# Altium schematic sheet Tiny817_Xplained_Pro_Target_MCU.SchDoc: Target MCU
size A3; Organization: ATMEL Norway; Address1: Vestre Rosten 79; Address2: N-7075 TILLER; Address3: NORWAY; DocumentNumber: A09-2654; Revision: 4; SheetNumber: 2; SheetTotal: 9; PageSetup: Record=PageOptions|CenterHorizontal=True|CenterVertical=True|PrintScale=1.01|XCorrection=1.00|YCorrection=1.00|PrintKind=1|BorderSize=5000000|LeftOffset=0|BottomOffset=0|Orientation=2|PaperLength=1000|PaperWidth=1000|Scale=100|PaperSource=7|PrintQuality=-4|MediaType=1|DitherType=10|PaperKind=A3 (297 x 420 mm)|PrintScaleMode=1
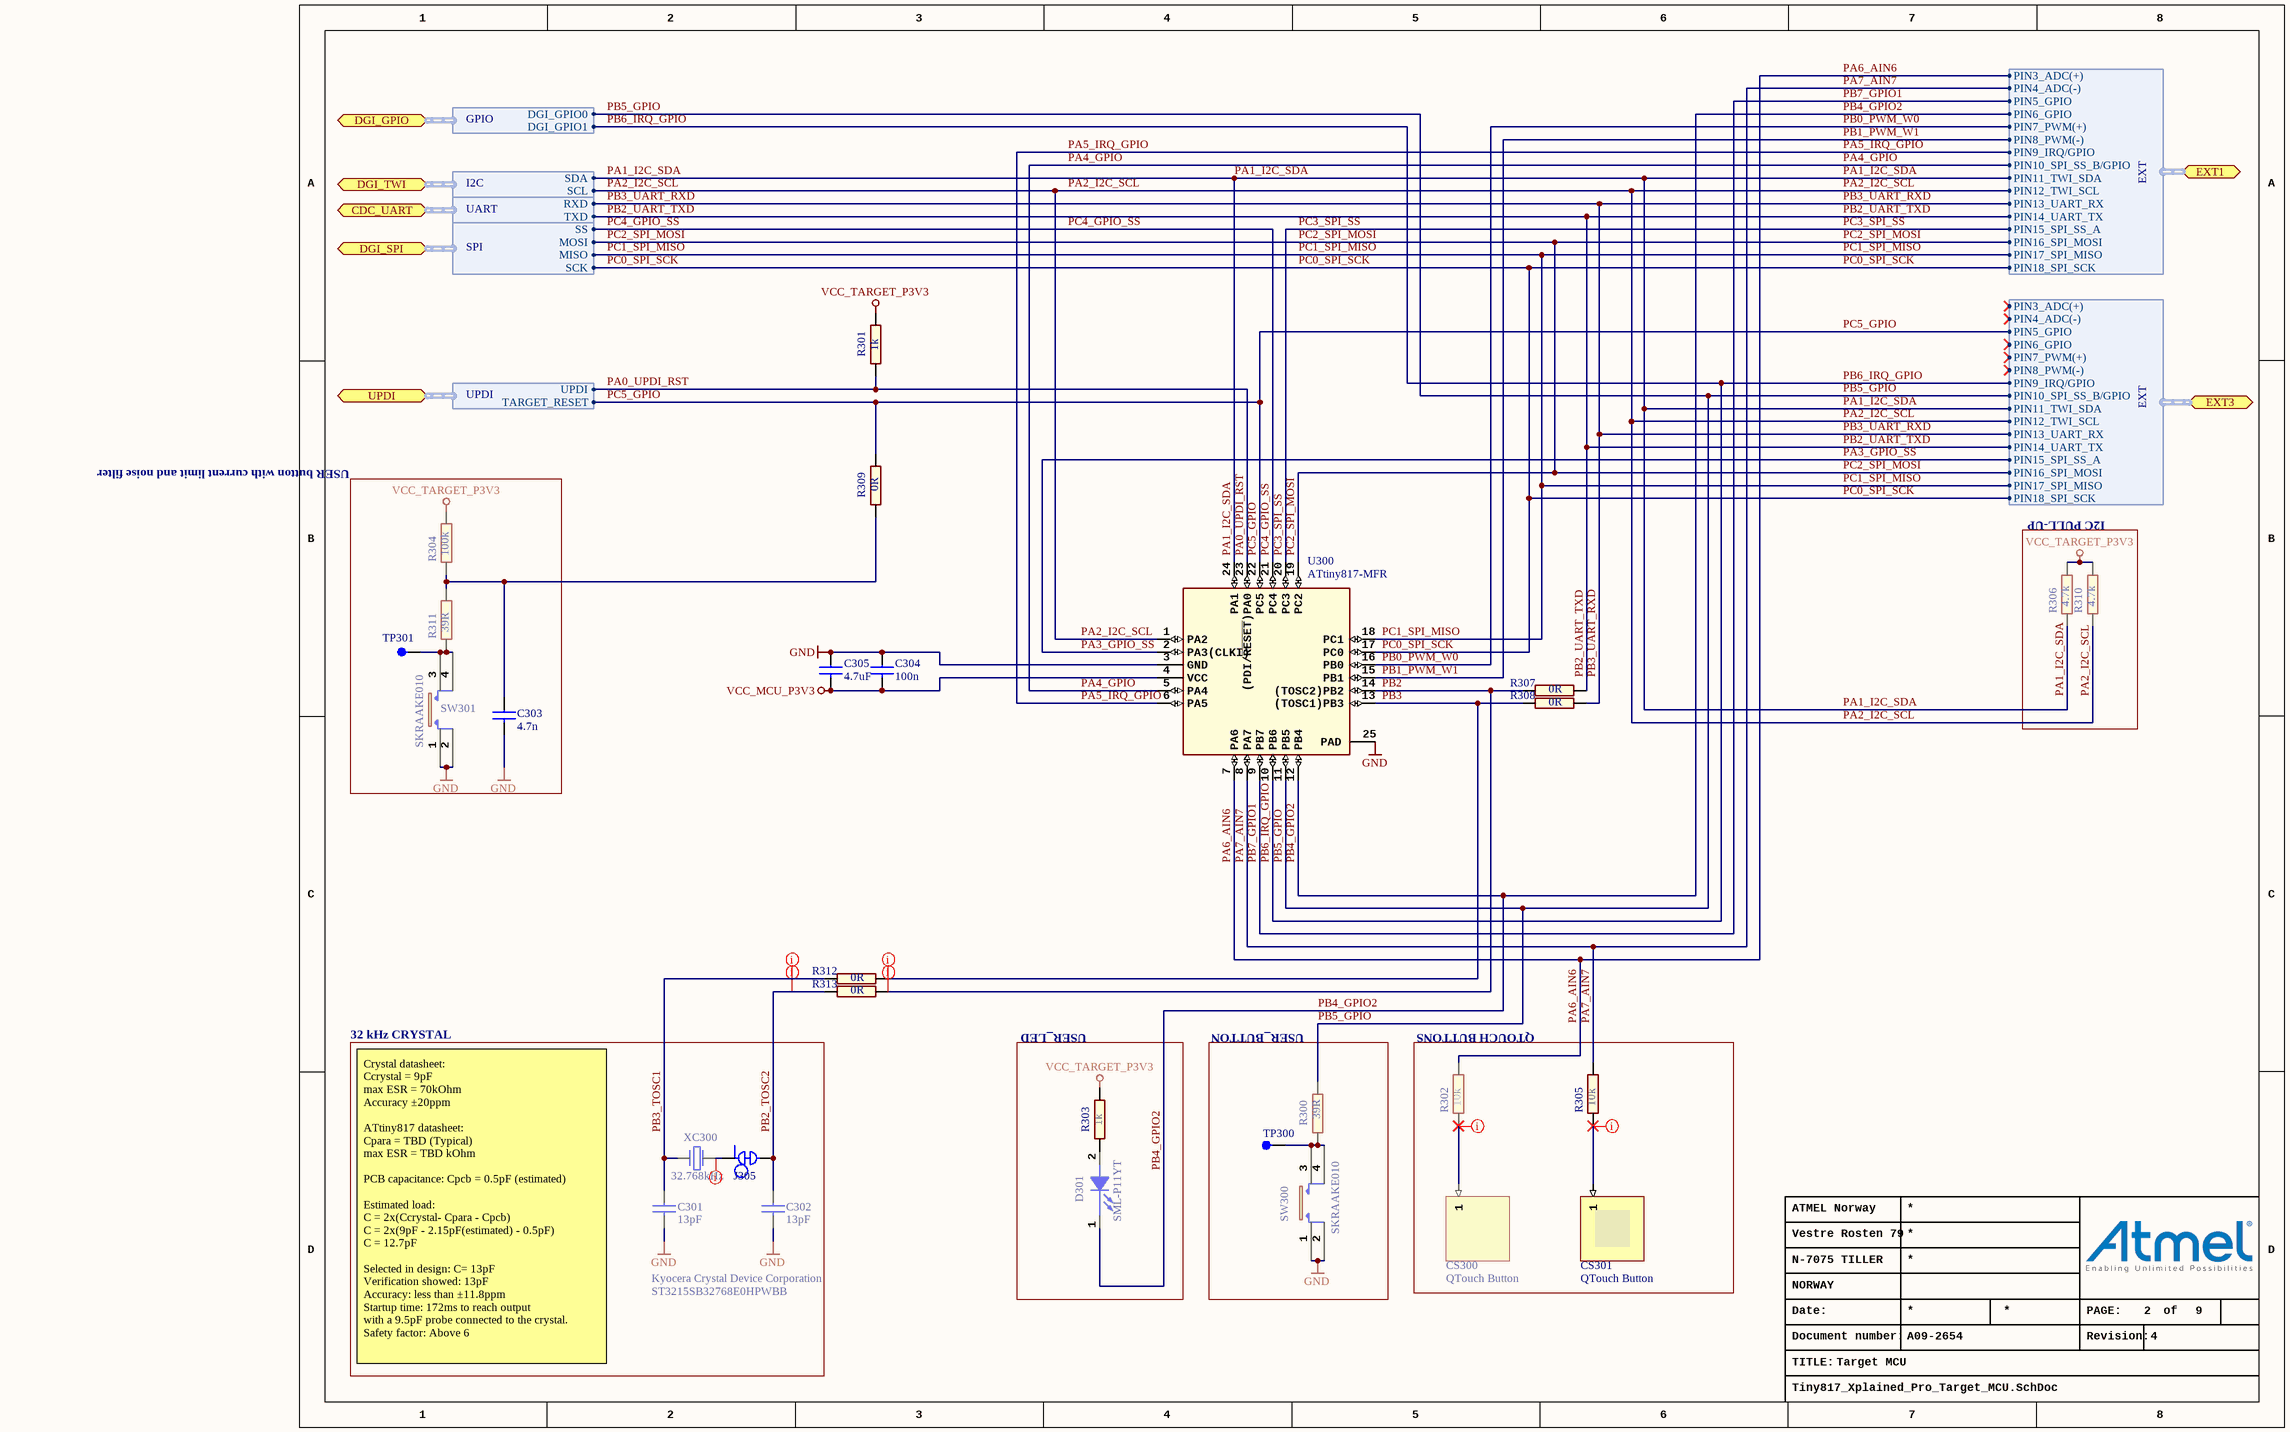
[diagram p0: Tiny817_Xplained_Pro_Target_MCU.SchDoc]

## Parts
C301  value 13pF  [AP1-00053]
C302  value 13pF  [AP1-00053]
C303  value 4.7n  [AP1-00053]
C304  value 100n  [AP1-00053]
C305  value 4.7uF  [AP1-00117]
CS300  QTouch Button  (no BOM)
CS301  QTouch Button  (no BOM)
D301  value SML-P11YT  [AP4-00160]
J305  (no value)  [AP9-00044]  (net tie, no BOM)
R300  value 39R  [AP2-00011]
R301  value 1k  [AP2-00011]
R302  value 10k  [AP2-00011]
R303  value 1k  [AP2-00011]
R304  value 100k  [AP2-00011]
R305  value 10k  [AP2-00011]
R306  value 4.7k  [AP2-00011]
R307  value 0R  [AP2-00011]
R308  value 0R  [AP2-00011]
R309  value 0R  [AP2-00011]
R310  value 4.7k  [AP2-00011]
R311  value 39R  [AP2-00011]
R312  value 0R  [AP2-00011]
R313  value 0R  [AP2-00011]
SW300  value SKRAAKE010  [AP8-00137]
SW301  value SKRAAKE010  [AP8-00137]
TP300  (no value)  [AP8-00010]  (no BOM)
TP301  (no value)  [AP8-00010]  (no BOM)
U300  value ATtiny817-MFR  [AP6-00459]  (hidden comment: ATtiny807)
XC300  value 32.768kHz  Manufacturer: Kyocera Crystal Device Corporation  MPN: ST3215SB32768E0HPWBB  [AP7-00090]

## Blocks framed on the sheet
USER button with current limit and noise filter: C303 R304 R311 SW301 TP301
I2C PULL-UP: R306 R310
32 kHz CRYSTAL: C301 C302 J305 XC300
USER_LED: D301 R303
USER_BUTTON: R300 SW300 TP300
QTOUCH BUTTONS: CS300 CS301 R302 R305

## Ports
CDC_UART (harness UART), DGI_GPIO (harness GPIO), DGI_SPI (harness SPI), DGI_TWI (harness I2C), EXT1 (harness EXT), EXT3 (harness EXT), UPDI (harness UPDI)

## Harnesses
UPDI: UPDI, TARGET_RESET
GPIO: DGI_GPIO0, DGI_GPIO1
SPI: MISO, MOSI, SCK, SS
I2C: SCL, SDA
UART: RXD, TXD
EXT: PIN10_SPI_SS_B/GPIO, PIN11_TWI_SDA, PIN12_TWI_SCL, PIN13_UART_RX, PIN14_UART_TX, PIN15_SPI_SS_A, PIN16_SPI_MOSI, PIN17_SPI_MISO, PIN18_SPI_SCK, PIN3_ADC(+), PIN4_ADC(-), PIN5_GPIO, PIN6_GPIO, PIN7_PWM(+), PIN8_PWM(-), PIN9_IRQ/GPIO

## Nets
GND: C301.2 C302.2 C303.2 C304.1 C305.1 SW300.1 SW300.2 SW301.1 SW301.2 U300.3(GND) U300.25(PAD)
VCC_MCU_P3V3: C304.2 C305.2 U300.4(VCC)
VCC_TARGET_P3V3: R301.2 R303.2 R304.2 R306.2 R310.2
PA0_UPDI_RST: R301.1 U300.23((PDI/~{RESET})PA0) ; port UPDI.UPDI
PA1_I2C_SDA: R306.1 U300.24(PA1) ; port DGI_TWI.SDA, port EXT1.PIN11_TWI_SDA, port EXT3.PIN11_TWI_SDA
PA2_I2C_SCL: R310.1 U300.1(PA2) ; port DGI_TWI.SCL, port EXT1.PIN12_TWI_SCL, port EXT3.PIN12_TWI_SCL
PA3_GPIO_SS: U300.2(PA3(CLKI)) ; port EXT3.PIN15_SPI_SS_A
PA4_GPIO: U300.5(PA4) ; port EXT1.PIN10_SPI_SS_B/GPIO
PA5_IRQ_GPIO: U300.6(PA5) ; port EXT1.PIN9_IRQ/GPIO
PA6_AIN6: R302.2 U300.7(PA6) ; port EXT1.PIN3_ADC(+)
PA7_AIN7: R305.2 U300.8(PA7) ; port EXT1.PIN4_ADC(-)
PB0_PWM_W0: U300.16(PB0) ; port EXT1.PIN7_PWM(+)
PB1_PWM_W1: U300.15(PB1) ; port EXT1.PIN8_PWM(-)
PB2: R307.2 R313.1 U300.14((TOSC2)PB2)
PB2_TOSC2: C302.1 J305.2 R313.2
PB2_UART_TXD: R307.1 ; port CDC_UART.TXD, port EXT1.PIN14_UART_TX, port EXT3.PIN14_UART_TX
PB3: R308.2 R312.1 U300.13((TOSC1)PB3)
PB3_TOSC1: C301.1 R312.2 XC300.2
PB3_UART_RXD: R308.1 ; port CDC_UART.RXD, port EXT1.PIN13_UART_RX, port EXT3.PIN13_UART_RX
PB4_GPIO2: D301.1(CATHODE) U300.12(PB4) ; port EXT1.PIN6_GPIO
PB5_GPIO: R300.2 U300.11(PB5) ; port DGI_GPIO.DGI_GPIO0, port EXT3.PIN10_SPI_SS_B/GPIO
PB6_IRQ_GPIO: U300.10(PB6) ; port DGI_GPIO.DGI_GPIO1, port EXT3.PIN9_IRQ/GPIO
PB7_GPIO1: U300.9(PB7) ; port EXT1.PIN5_GPIO
PC0_SPI_SCK: U300.17(PC0) ; port DGI_SPI.SCK, port EXT1.PIN18_SPI_SCK, port EXT3.PIN18_SPI_SCK
PC1_SPI_MISO: U300.18(PC1) ; port DGI_SPI.MISO, port EXT1.PIN17_SPI_MISO, port EXT3.PIN17_SPI_MISO
PC2_SPI_MOSI: U300.19(PC2) ; port DGI_SPI.MOSI, port EXT1.PIN16_SPI_MOSI, port EXT3.PIN16_SPI_MOSI
PC3_SPI_SS: U300.20(PC3) ; port EXT1.PIN15_SPI_SS_A
PC4_GPIO_SS: U300.21(PC4) ; port DGI_SPI.SS
PC5_GPIO: R309.1 U300.22(PC5) ; port UPDI.TARGET_RESET, port EXT3.PIN5_GPIO
NetC303_1: C303.1 R304.1 R309.2 R311.2
NetCS300_1: CS300.1 R302.1
NetCS301_1: CS301.1 R305.1
NetD301_2: D301.2(ANODE) R303.1
NetJ305_1: J305.1 XC300.1
NetR300_1: R300.1 SW300.3 SW300.4 TP300.1
NetR311_1: R311.1 SW301.3 SW301.4 TP301.1

## Layout directives
rule Assembly Testpoint Usage [Testpoint - Not Allowed    Multiple - Not Allowed]: NetCS300_1, NetCS301_1, NetJ305_1, PB2, PB2_TOSC2, PB3, PB3_TOSC1

## Notes on the sheet
- Crystal datasheet:
  Ccrystal = 9pF
  max ESR = 70kOhm
  Accuracy ±20ppm
  ATtiny817 datasheet:
  Cpara = TBD (Typical)
  max ESR = TBD kOhm
  PCB capacitance: Cpcb = 0.5pF (estimated)
  Estimated load:
  C = 2x(Ccrystal- Cpara - Cpcb)
  C = 2x(9pF - 2.15pF(estimated) - 0.5pF)
  C = 12.7pF
  Selected in design: C= 13pF
  Verification showed: 13pF
  Accuracy: less than ±11.8ppm
  Startup time: 172ms to reach output
  with a 9.5pF probe connected to the crystal.
  Safety factor: Above 6
- Date:
- PAGE:
- of
- TITLE:
- Document number:
- Revision:

## Library data of the parts
C301 C302 = A01-0793: Ceramic capacitor, SMD 0402, NP0, 50V, +/-5%; PartGroup: Capacitors,Ceramic,SMD 0402; Manufacturer: Murata; MPN: GRM1555C1H130JA01D; Tolerance: 5%; TemperatureRange: -55 - +125 deg C; AN: A01-0793
C303 = A01-0046: Ceramic capacitor, SMD 0402, X7R, 25V, +/-10% (de35287); PartGroup: Capacitors,Ceramic,SMD 0402; Manufacturer: PHYCOMP; MPN: 2238 587 15632; TemperatureRange: -55 - +125 deg C; AN: A01-0046; Tolerance: 25V, +/-10%; Height: 0,550000011920929
C304 = A01-0246: Ceramic capacitor, SMD 0402, X7R, 16V, +/-10%; PartGroup: Capacitors,Ceramic,SMD 0402; Manufacturer: Kemet; MPN: C0402C104K4RACTU; TemperatureRange: -55 - +125 deg C; AN: A01-0246; Tolerance: 16V, +/-10%; Height: 0,5
C305 = A01-0377: Ceramic capacitor, SMD 0603, X5R, 10V, 10% (de31036); PartGroup: Capacitors,Ceramic,SMD 0603; Manufacturer: WALSIN Technology Corporation; MPN: 0603X475K100CT; TemperatureRange: -55 - +85 deg C; AN: A01-0377; Tolerance: 10%; Height: 0,800000011920929
CS300 CS301 = QTouchButton: ConfiguratorName: ATMEL_TOUCH; ConfigurationParameters: {}__sensorid[1]{}width[8]{}height[8]{}
D301 = A10-0182: LED, SMD 0402, Yellow, Wave length=586nm, 7.6mcd @ (1mA, 1.9Vf); PartGroup: Opto,LEDs,SMD; Manufacturer: ROHM; MPN: SML-P11YT-T86; TemperatureRange: -40 to +85; AN: A10-0182; Height: 0,200000002980232
J305 = A09-0783: Default closed SMD strap, 0603 size; PartGroup: Mechanical devices,PCB implemented components; Value: SMD-STRAP_0603_CLOSED; AN: A09-0783; Height: 0
R300 R311 = A02-0178: Thick film resistor, SMD 0402, 1/16W, 1%; PartGroup: Resistors,SMD,0402 1%; Manufacturer: ASJ; MPN: CR10-39R0-FK; TemperatureRange: -55 - +125 deg C; AN: A02-0178; Tolerance: 1 %; Height: 0,349999994039536
R301 R303 = A02-0212: Thick film resistor, SMD 0402, 1/16W, 1%; PartGroup: Resistors,SMD,0402 1%; Manufacturer: ASJ; MPN: CR10-1001-FK; TemperatureRange: -55 - +125 deg C; AN: A02-0212; Tolerance: 1 %; Height: 0,349999994039536
R302 R305 = A02-0236: Thick film resistor, SMD 0402, 1/16W, 1%; PartGroup: Resistors,SMD,0402 1%; Manufacturer: vishay; MPN: CRCW040210K0FKED; TemperatureRange: -55 - +125 deg C; AN: A02-0236; Tolerance: 1 %; Height: 0,349999994039536
R304 = A02-0260: Thick film resistor, SMD 0402, 1/16W, 1%; PartGroup: Resistors,SMD,0402 1%; Manufacturer: ASJ; MPN: CR10-1003-FK; TemperatureRange: -55ï¿½ to +125ï¿½C; AN: A02-0260; Tolerance: 1 %; Height: 0,349999994039536
R306 R310 = A02-0228: Thick film resistor, SMD 0402, 1/16W, 1%; PartGroup: Resistors,SMD,0402 1%; Manufacturer: PHYCOMP; MPN: 2322 706 74702L; TemperatureRange: -55ï¿½ to +125ï¿½C; AN: A02-0228; Tolerance: 1 %; Height: 0,349999994039536
R307-R309 R312 R313 = A02-0163: RES 0.0 OHM 1/16W 0402 SMD; PartGroup: Resistors,SMD,0402 1%; Manufacturer: (n/a); MPN: RMCF0402ZT0R00; Tolerance: 1 %; TemperatureRange: -55 - +125 deg C; AN: A02-0163; Height: 0,349999994039536
SW300 SW301 = A08-0790: 6.2x6.2 mm SMD tact switch, same as A08-0091 but less force is needed; PartGroup: Mechanical devices,Switches,SMD; Manufacturer: ALPS; TemperatureRange: -30 - +90 deg C; AN: A08-0790; Height: 5,09999990463257; MPN: SKRAAKE010
TP300 TP301 = A08-0004: Single SMD testpad; PartGroup: Mechanical devices,Connectors,Test points; AN: A08-0004; Value: TESTPAD; Height: 0
U300 = A06-1373: Atmel 8-bit RISC MCU; PartGroup: Integrated Circuits,MCU, MPU, DSP,AVR MCU; TemperatureRange: -40Â°C +125Â°C; ComponentStatus: 'Active (verified)'; AN: A06-1373; Height: 0,899999976158142; Manufacturer: ATMEL; MPN: ATTINY817-MFR; FootprintStatus: 'Active (Verified)'
XC300 = A07-0129: Kyocera ST3215SB32768E0HPWBB, 32.768kHz, 9pF, SMD tuning fork crystal; PartGroup: Frequency devices,Crystals,SMD; Tolerance: Â±20ppm; TemperatureRange: -40Â°C to +85Â°C; AN: A07-0129; Height: 0,800000011920929